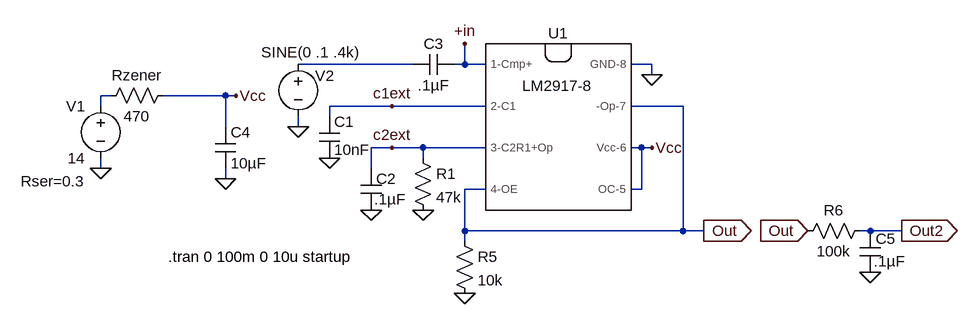
[diagram p0: schematic LM2917-8 test.asc]
LM2917-8 test.asc, the LTspice schematic file:
Version 4
SHEET 1 1572 772
WIRE 336 -496 160 -496
WIRE 416 -496 416 -528
WIRE 416 -496 400 -496
WIRE 448 -496 416 -496
WIRE 704 -496 672 -496
WIRE 704 -480 704 -496
WIRE -128 -448 -144 -448
WIRE 48 -448 -48 -448
WIRE 64 -448 48 -448
WIRE -144 -432 -144 -448
WIRE 304 -432 208 -432
WIRE 448 -432 304 -432
WIRE 752 -432 672 -432
WIRE 208 -416 208 -432
WIRE 48 -400 48 -448
WIRE 160 -400 160 -416
WIRE 304 -368 272 -368
WIRE 352 -368 304 -368
WIRE 448 -368 352 -368
WIRE 688 -368 672 -368
WIRE 704 -368 688 -368
WIRE 352 -352 352 -368
WIRE -144 -336 -144 -352
WIRE 272 -336 272 -368
WIRE 48 -320 48 -336
WIRE 448 -304 416 -304
WIRE 688 -304 688 -368
WIRE 688 -304 672 -304
WIRE 416 -240 416 -304
WIRE 752 -240 752 -432
WIRE 752 -240 416 -240
WIRE 784 -240 752 -240
WIRE 1040 -240 1024 -240
WIRE 1088 -240 1040 -240
WIRE 416 -224 416 -240
FLAG -144 -336 0
FLAG 64 -448 Vcc
FLAG 704 -480 0
FLAG 704 -368 Vcc
FLAG 208 -352 0
FLAG 352 -272 0
FLAG 272 -272 0
FLAG 416 -144 0
FLAG 160 -400 0
FLAG 416 -528 +in
FLAG 304 -432 c1ext
FLAG 304 -368 c2ext
FLAG 784 -240 Out
IOPIN 784 -240 Out
FLAG 48 -320 0
FLAG 944 -240 Out
IOPIN 944 -240 In
FLAG 1088 -240 Out2
IOPIN 1088 -240 Out
FLAG 1040 -176 0
SYMBOL voltage -144 -448 M0
WINDOW 123 0 0 Left 0
WINDOW 39 24 132 Left 0
SYMATTR SpiceLine Rser=0.3
SYMATTR InstName V1
SYMATTR Value 14
SYMBOL cap 192 -416 R0
WINDOW 0 23 8 Left 0
WINDOW 3 23 51 Left 0
SYMATTR InstName C1
SYMATTR Value 10nF
SYMBOL cap 256 -336 R0
WINDOW 0 24 16 Left 0
WINDOW 3 21 47 Left 0
SYMATTR InstName C2
SYMATTR Value .1µF
SYMBOL res 336 -368 R0
SYMATTR InstName R1
SYMATTR Value 47k
SYMBOL res 400 -240 R0
SYMATTR InstName R5
SYMATTR Value 10k
SYMBOL cap 336 -480 R270
WINDOW 0 32 32 VTop 0
WINDOW 3 0 32 VBottom 0
SYMATTR InstName C3
SYMATTR Value .1µF
SYMBOL voltage 160 -512 R0
WINDOW 3 -57 -3 Left 0
WINDOW 123 0 0 Left 0
WINDOW 39 0 0 Left 0
WINDOW 0 26 33 Left 0
SYMATTR Value SINE(0 .1 .4k)
SYMATTR InstName V2
SYMBOL res -144 -432 R270
WINDOW 0 32 56 VTop 0
WINDOW 3 0 56 VBottom 0
SYMATTR InstName Rzener
SYMATTR Value 470
SYMBOL cap 32 -400 R0
SYMATTR InstName C4
SYMATTR Value 10µF
SYMBOL res 928 -224 R270
WINDOW 0 32 56 VTop 0
WINDOW 3 0 56 VBottom 0
SYMATTR InstName R6
SYMATTR Value 100k
SYMBOL cap 1024 -240 R0
WINDOW 0 24 12 Left 0
WINDOW 3 21 47 Left 0
SYMATTR InstName C5
SYMATTR Value .1µF
SYMBOL Misc\\LM2917-8 560 -400 R0
SYMATTR InstName U1
TEXT -40 -200 Left 0 !.tran 0 100m 0 10u startup

The netlist it stands for:
* LM2917-8 test.asc
V1 N002 0 14 Rser=0.3
C1 c1ext 0 10nF
C2 c2ext 0 .1µF
R1 c2ext 0 47k
R5 Out 0 10k
C3 N001 +in .1µF
V2 N001 0 SINE(0 .1 .4k)
Rzener N002 Vcc 470
C4 Vcc 0 10µF
R6 Out Out2 100k
C5 Out2 0 .1µF
XU1 +in c1ext c2ext Out Vcc Vcc Out 0 LM2917-8  ; pins 1-Cmp+ 2-C1 3-C2R1+Op 4-OE OC-5 Vcc-6 -Op-7 GND-8
.tran 0 100m 0 10u startup
.lib LM29x7.SUB
.backanno
.end